# Altium schematic sheet Connectors.SchDoc
size A; SheetNumber: 2; SheetTotal: 6
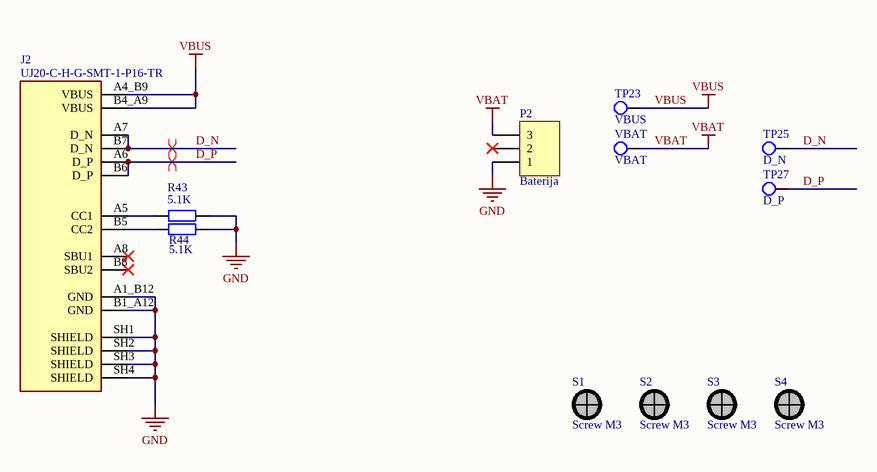
[diagram p0: Connectors.SchDoc]

## Parts
J2  UJ20-C-H-G-SMT-1-P16-TR  [SAMESKY_UJ20-C-H-G-SMT-1-P16-TR]
P2  Baterija  [S3B-XH-A-1(LF)(SN)]
R43  5.1K  [SMD-0402-RES]
R44  5.1K  [SMD-0402-RES]
S1  Screw M3  [M3]
S2  Screw M3  [M3]
S3  Screw M3  [M3]
S4  Screw M3  [M3]
TP23  VBUS  [testpoint 1 mm]  (no BOM)
TP25  D_N  [testpoint 1 mm]  (no BOM)
TP27  D_P  [testpoint 1 mm]  (no BOM)
VBAT  VBAT  [testpoint 1 mm]  (no BOM)

## Nets
GND: J2.A1_B12(GND) J2.B1_A12(GND) J2.SH1(SHIELD) J2.SH2(SHIELD) J2.SH3(SHIELD) J2.SH4(SHIELD) P2.1 R43.1 R44.1
VBAT: P2.3 VBAT.1
VBUS: J2.A4_B9(VBUS) J2.B4_A9(VBUS) TP23.1
D_N: J2.A7(D_N) J2.B7(D_N) TP25.1
D_P: J2.A6(D_P) J2.B6(D_P) TP27.1
NetJ2_A5: J2.A5(CC1) R43.2
NetJ2_B5: J2.B5(CC2) R44.2

Not connected (* = marked no-connect by the designer): J2 A8(SBU1)* B8(SBU2)*; P2 2*

## Layout directives
differential pair: D_N, D_P

## Library data of the parts
J2 = UJ20-C-H-G-SMT-1-P16-TR: USB-C (USB TYPE-C) USB 2.0 Receptacle Connector 24 (16+8 Dummy) Position Surface Mount, Right Angle; Through Hole; MF: Same Sky; SnapEDA_Link: https://www.snapeda.com/parts/UJ20-C-H-G-SMT-1-P16-TR/Same+Sky/view-part/?ref=snap; Package: None; Value: *; MP: UJ20-C-H-G-SMT-1-P16-TR; Check_prices: https://www.snapeda.com/parts/UJ20-C-H-G-SMT-1-P16-TR/Same+Sky/view-part/?ref=eda; Supplier 1: Mouser; Supplier Part Number 1: 179-UJ20CHGSMT1P16TR
P2 = Header 3: S3B-XH-A-1(LF)(SN); LatestRevisionDate: 17-Jul-2002; LatestRevisionNote: Re-released for DXP Platform.; Publisher: Altium Limited; Supplier 1: Mouser; Supplier Part Number 1: 306-S3BXHA1LFSN
R43 R44 = Res2: Resistor; Published: 8-Jun-2000; LatestRevisionDate: 17-Jul-2002; LatestRevisionNote: Re-released for DXP Platform.; PackageReference: AXIAL-0.4; Publisher: Altium Limited; PackageDescription: Axial Device, Thru-Hole; 2 Leads; 0.4 in Pin Spacing; Value: 5.1K; Supplier 1: Mouser; Supplier Part Number 1: 708-RMCF0402FT5K10
TP23 TP25 TP27 VBAT = testpoint